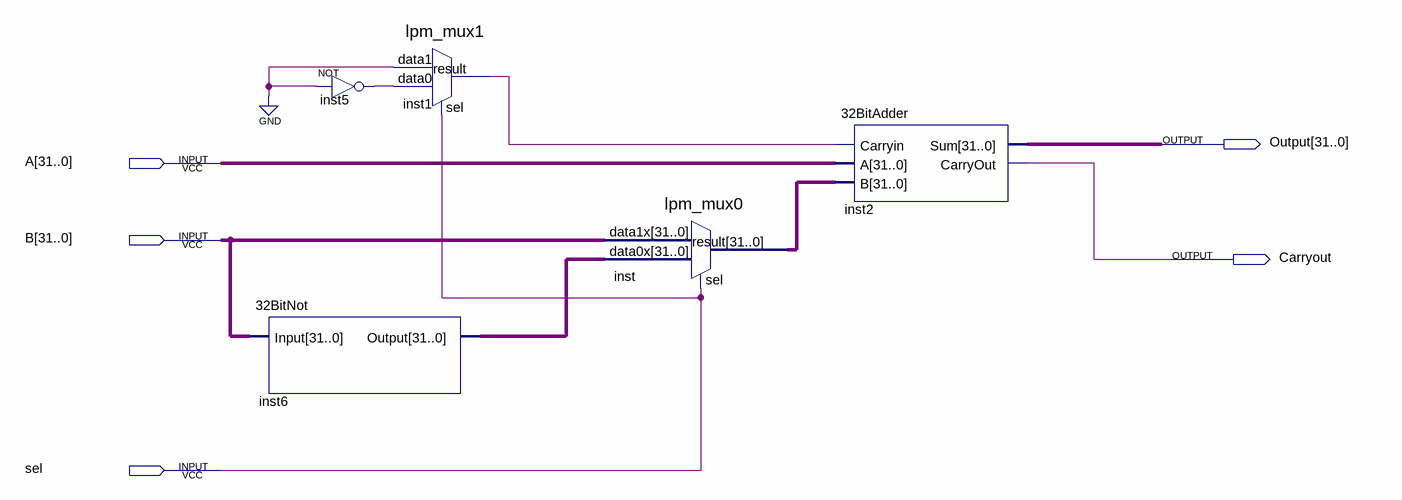
[diagram p0: schematic sheet]
// Quartus schematic 32BitAddSub.bdf as structural Verilog: 5 symbols, 5 pins
module \32BitAddSub  (
  input  [31:0] A,
  input  [31:0] B,
  input  sel,
  output [31:0] Output,
  output Carryout
);

  wire inst1_result, inst5_out;
  wire [31:0] inst6_output, inst_result;

  \32BitNot  inst6 (.Input(B), .Output(inst6_output));
  not inst5 (inst5_out, 1'b0);
  lpm_mux1 inst1 (.data1(1'b0), .data0(inst5_out), .sel(sel), .result(inst1_result));
  lpm_mux0 inst (.data1x(B), .data0x(inst6_output), .sel(sel), .result(inst_result));
  \32BitAdder  inst2 (.Carryin(inst1_result), .A(A), .B(inst_result), .Sum(Output), .CarryOut(Carryout));
endmodule
